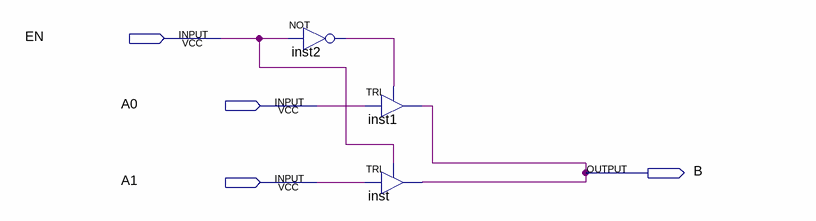
[diagram p0: schematic sheet]
// Quartus schematic ep2_2_2.bdf as structural Verilog: 3 symbols, 4 pins
module ep2_2_2 (
  input  EN,
  input  A0,
  input  A1,
  output B
);

  wire inst2_out;

  not inst2 (inst2_out, EN);
  TRI inst1 (.IN(A0), .OE(inst2_out), .OUT(B));
  TRI inst (.IN(A1), .OE(EN), .OUT(B));
endmodule
